# Altium schematic sheet FMB-USB.SchDoc
size A4
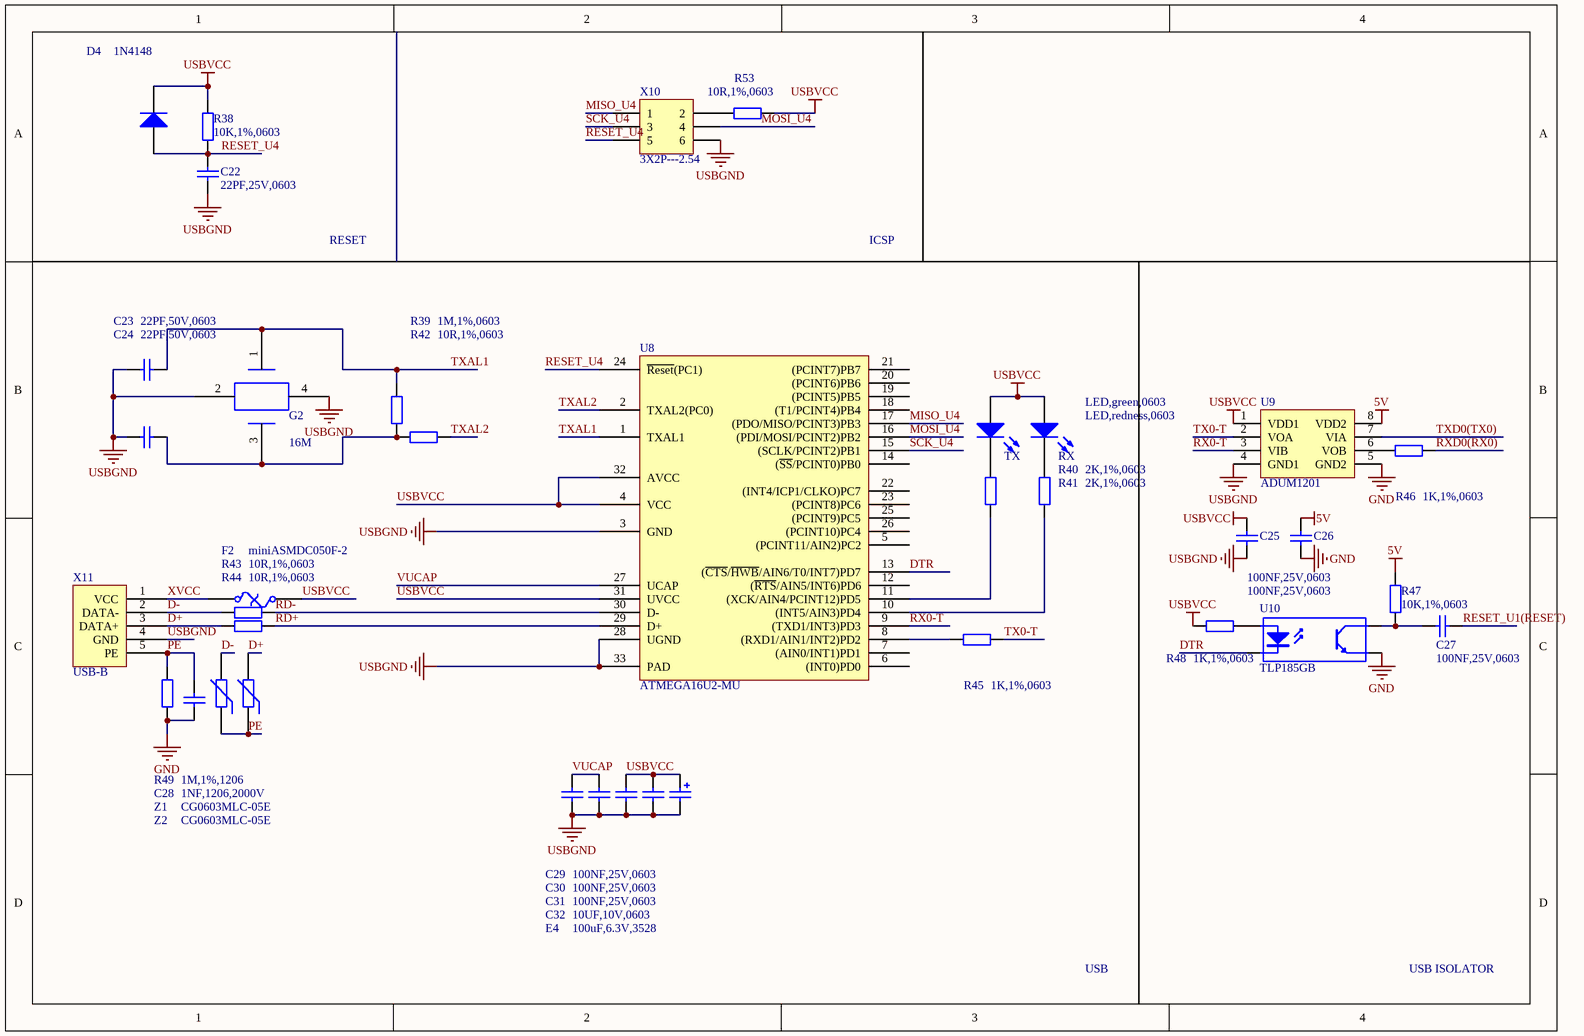
[diagram p0: FMB-USB.SchDoc]

## Parts
C22  22PF,25V,0603  [RC0603]
C23  22PF,50V,0603  [RC0603]
C24  22PF,50V,0603  [RC0603]
C25  100NF,25V,0603  [RC0603]
C26  100NF,25V,0603  [RC0603]
C27  100NF,25V,0603  [RC0603]
C28  1NF,1206,2000V  [RC1206]
C29  100NF,25V,0603  [RC0603]
C30  100NF,25V,0603  [RC0603]
C31  100NF,25V,0603  [RC0603]
C32  10UF,10V,0603  [RC0603]
D4  1N4148  [SOD-323]
E4  100uF,6.3V,3528  [3528-21]
F2  miniASMDC050F-2  [RC1812]
G2  16M  [Y-3225]
R38  10K,1%,0603  [RC0603]
R39  1M,1%,0603  [RC0603]
R40  2K,1%,0603  [RC0603]
R41  2K,1%,0603  [RC0603]
R42  10R,1%,0603  [RC0603]
R43  10R,1%,0603  [RC0603]
R44  10R,1%,0603  [RC0603]
R45  1K,1%,0603  [RC0603]
R46  1K,1%,0603  [RC0603]
R47  10K,1%,0603  [RC0603]
R48  1K,1%,0603  [RC0603]
R49  1M,1%,1206  [RC1206]
R53  10R,1%,0603  [RC0603]
RX  LED,redness,0603  [LED-0603]
TX  LED,green,0603  [LED-0603]
U8  ATMEGA16U2-MU  [QFN-32]
U9  ADUM1201  [SO-8N]
U10  TLP185GB  [SO-4]
X10  3X2P---2.54  [HDR2X3]
X11  USB-B  [USB-B180]
Z1  CG0603MLC-05E  [RC0603]
Z2  CG0603MLC-05E  [RC0603]

## Nets
5V: C26.1 R47.2 U9.8(VDD2)
GND: C26.2 C28.1 R49.1 U9.5(GND2) U10.3(E)
USBGND: C22.2 C23.2 C24.2 C25.1 C29.1 C30.1 C31.1 C32.1 E4.2 G2.2 G2.4 U8.3(GND) U8.28(UGND) U8.33(PAD) U9.4(GND1) X10.6 X11.4(GND)
USBVCC: C25.2 C31.2 C32.2 D4.2(K) E4.1 F2.2 R38.1 R48.1 R53.1 RX.1(A) TX.1(A) U8.4(VCC) U8.31(UVCC) U8.32(AVCC) U9.1(VDD1)
D+: R44.1 X11.3(DATA+) Z2.2
D-: R43.1 X11.2(DATA-) Z1.2
DTR: U8.13((~{CTS}/~{HWB}/AIN6/T0/INT7)PD7) U10.2(K)
MISO_U4: U8.17((PDO/MISO/PCINT3)PB3) X10.1
MOSI_U4: U8.16((PDI/MOSI/PCINT2)PB2) X10.4
PE: C28.2 R49.2 X11.5(PE) Z1.1 Z2.1
RD+: R44.2 U8.29(D+)
RD-: R43.2 U8.30(D-)
RESET_U1(RESET): C27.1
RESET_U4: C22.1 D4.1(A) R38.2 U8.24(~{Reset}(PC1)) X10.5
RX0-T: U8.9((TXD1/INT3)PD3) U9.3(VIB)
RXD0(RX0): R46.1
SCK_U4: U8.15((SCLK/PCINT2)PB1) X10.3
TX0-T: R45.1 U9.2(VOA)
TXAL1: C23.1 G2.1 R39.1 U8.1(TXAL1)
TXAL2: R42.2 U8.2(TXAL2(PC0))
TXD0(TX0): U9.7(VIA)
VUCAP: C29.2 C30.2 U8.27(UCAP)
XVCC: F2.1 X11.1(VCC)
NetC24_1: C24.1 G2.3 R39.2 R42.1
NetC27_2: C27.2 R47.1 U10.4(C)
NetR40_1: R40.1 TX.2(K)
NetR40_2: R40.2 U8.11((XCK/AIN4/PCINT12)PD5)
NetR41_1: R41.1 RX.2(K)
NetR41_2: R41.2 U8.10((INT5/AIN3)PD4)
NetR45_2: R45.2 U8.8((RXD1/AIN1/INT2)PD2)
NetR46_2: R46.2 U9.6(VOB)
NetR48_2: R48.2 U10.1(A)
NetR53_2: R53.2 X10.2

Not connected (* = marked no-connect by the designer): U8 5((PCINT11/AIN2)PC2) 6((INT0)PD0) 7((AIN0/INT1)PD1) 12((~{RTS}/AIN5/INT6)PD6) 14((~{SS}/PCINT0)PB0) 18((T1/PCINT4)PB4) 19((PCINT5)PB5) 20((PCINT6)PB6) 21((PCINT7)PB7) 22((INT4/ICP1/CLKO)PC7) 23((PCINT8)PC6) 25((PCINT9)PC5) 26((PCINT10)PC4)

## Notes on the sheet
- RESET
- ICSP
- USB
- USB ISOLATOR

## Library data of the parts
C22-C32 = Cap: Capacitor; Value: 100pF; Published: 8-Jun-2000; LatestRevisionDate: 17-Jul-2002; LatestRevisionNote: Re-released for DXP Platform.; PackageReference: RAD-0.3; Publisher: Altium Limited; PackageDescription: Radial Cap, Thru-Hole; 2 Leads; 0.3 in Pin Spacing
D4 = Diode: Default Diode; Published: 8-Jun-2000; LatestRevisionDate: 17-Jul-2002; LatestRevisionNote: Re-released for DXP Platform.; PackageVersion: Sep-1996; PackageReference: SMC; Publisher: Altium Limited; PackageDescription: DO-214-AB/SMC; 2 C-Bend Leads; Body 7.9 x 5.9 mm, inc. leads (LxW); Code_JEDEC: DO-214-AB
E4 = Cap Pol2: Polarized Capacitor (Axial); Published: 8-Jun-2000; LatestRevisionDate: 17-Jul-2002; LatestRevisionNote: Re-released for DXP Platform.; PackageReference: POLAR0.8; Publisher: Altium Limited; PackageDescription: Polarized Capacitor; 2 Leads; Value: 100uF,6.3V,3528
F2 = Fuse Thermal: Thermal Fuse; Published: 24-Mar-1999; LatestRevisionDate: 17-Jul-2002; LatestRevisionNote: Re-released for DXP Platform.; PackageReference: PIN-W2/E2.8; Publisher: Altium Limited; PackageDescription: Thru-Hole; 2 Leads
G2 = G
R38-R44 R47 R49 R53 = Res2: Resistor; Value: 1K; Published: 8-Jun-2000; LatestRevisionDate: 17-Jul-2002; LatestRevisionNote: Re-released for DXP Platform.; PackageReference: AXIAL-0.4; Publisher: Altium Limited; PackageDescription: Axial Device, Thru-Hole; 2 Leads; 0.4 in Pin Spacing
R45 R46 R48 = Res2: Resistor; Published: 8-Jun-2000; LatestRevisionDate: 17-Jul-2002; LatestRevisionNote: Re-released for DXP Platform.; PackageReference: AXIAL-0.4; Publisher: Altium Limited; PackageDescription: Axial Device, Thru-Hole; 2 Leads; 0.4 in Pin Spacing; Value: 1K
RX TX = LED0: Typical INFRARED GaAs LED; Published: 8-Jun-2000; LatestRevisionDate: 08-Jul-2005; LatestRevisionNote: Mech Layer 1 removed.; PackageReference: LED-0; Publisher: Altium Limited; PackageDescription: LED; 2 Leads
U8 = ATMEGA8U2-MU
U10 = Optoisolator1: 4-Pin Phototransistor Optocoupler; Published: 24-Mar-1999; LatestRevisionDate: 04-Mar-2005; LatestRevisionNote: Sch pins 3 & 4 Swapped.; DatasheetVersion: Nov-2003; PackageReference: DIP-4; Publisher: Altium Limited
X10 = Header 3X2: Header, 3-Pin, Dual row; LatestRevisionDate: 17-Jul-2002; LatestRevisionNote: Re-released for DXP Platform.; Publisher: Altium Limited
X11 = B-USC
Z1 Z2 = Res Varistor: Varistor (Voltage-Sensitive Resistor); Published: 24-Mar-1999; LatestRevisionDate: 29-May-2009; LatestRevisionNote: IPC-7351 Footprint Added.; PackageVersion: Mar-2003; PackageReference: 6-0805; Publisher: Altium Limited; PackageDescription: Chip Resistor 0805 Case Size; Code_IPC: RESC2012